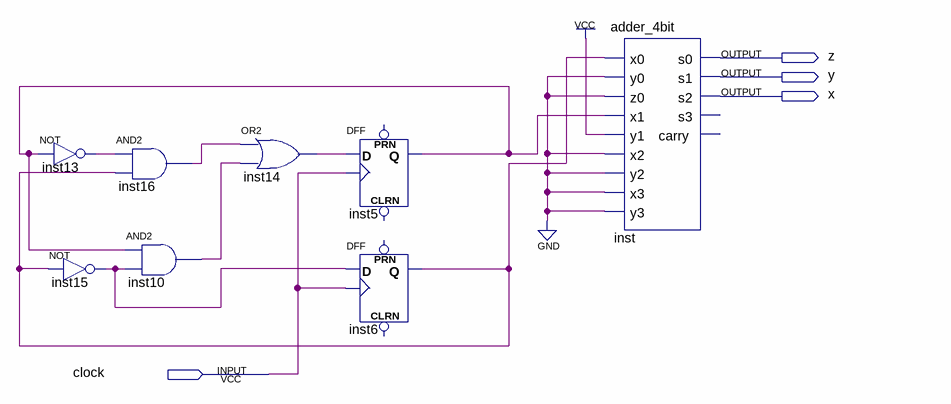
[diagram p0: schematic sheet]
// Quartus schematic count_2_5.bdf as structural Verilog: 8 symbols, 4 pins
module count_2_5 (
  input  clock,
  output z,
  output y,
  output x
);

  wire inst5_q, inst6_q, inst10_out, inst13_out, inst14_out, inst15_out, inst16_out;

  not inst13 (inst13_out, inst5_q);
  not inst15 (inst15_out, inst6_q);
  and inst16 (inst16_out, inst13_out, inst6_q);
  and inst10 (inst10_out, inst5_q, inst15_out);
  or inst14 (inst14_out, inst16_out, inst10_out);
  DFF inst5 (.CLK(clock), .D(inst14_out), .Q(inst5_q));  // open: CLRN, PRN
  DFF inst6 (.CLK(clock), .D(inst15_out), .Q(inst6_q));  // open: CLRN, PRN
  adder_4bit inst (
    .x0(inst6_q), .y0(1'b0), .z0(1'b0), .x1(inst5_q), .y1(1'b1), .x2(1'b0), .y2(1'b0), .x3(1'b0), .y3(1'b0),
    .s0(z), .s1(y), .s2(x));  // open: s3, carry
endmodule
